# EAGLE design 10_Board_A_V1 (EAGLE 9.5.0)
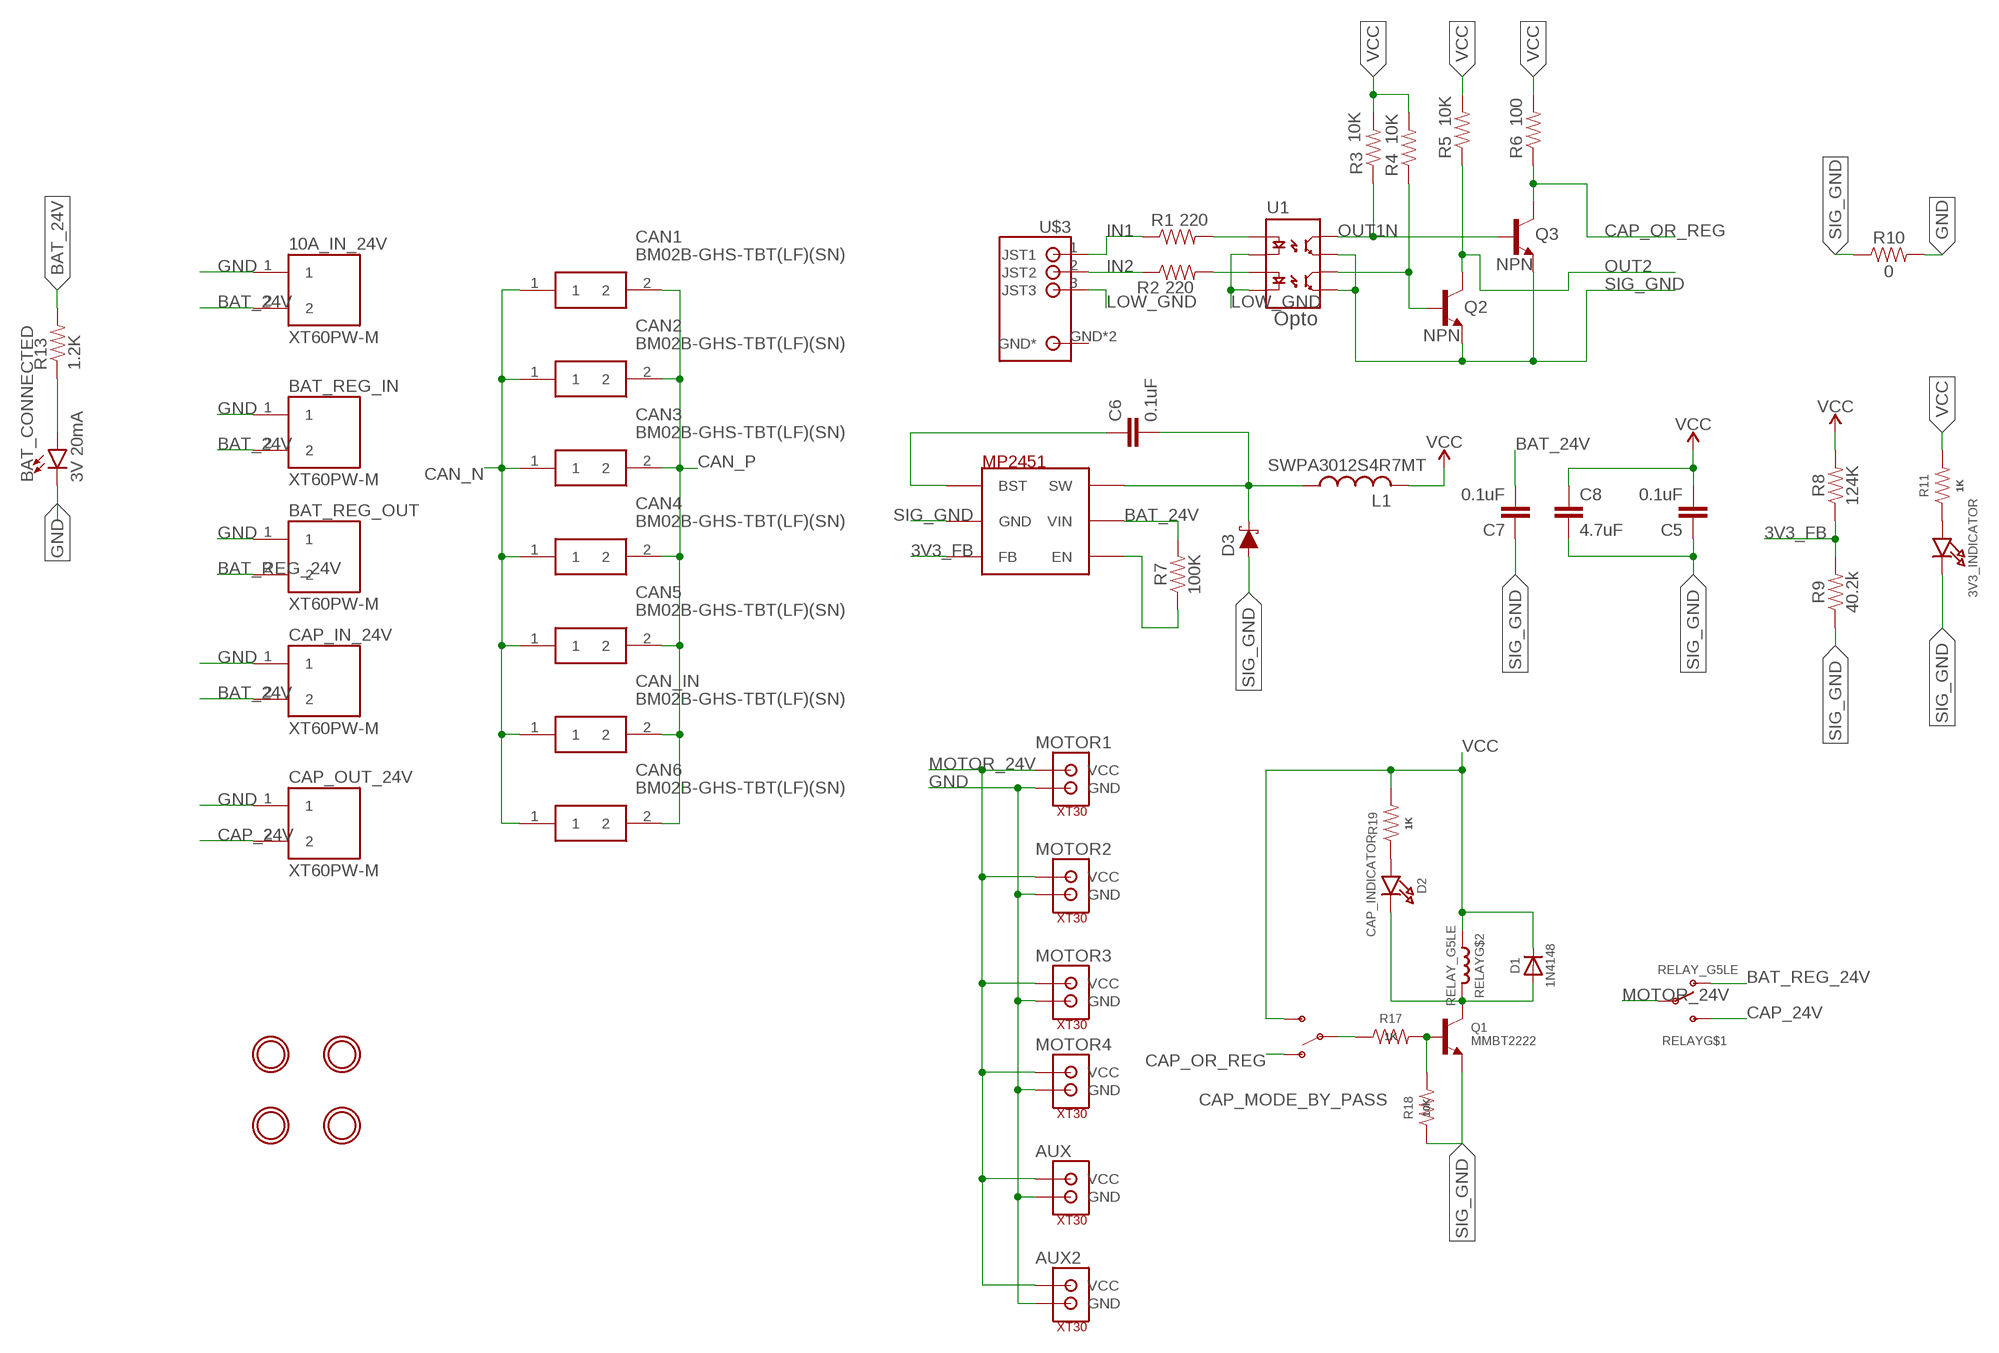
[diagram p0: schematic, sheet 1]

## Parts
3V3_INDICATOR  LED0805_NOOUTLINE  [CHIPLED_0805_NOOUTLINE]
10A_IN_24V  XT60PW-M  [AMASS_XT60PW-M]
AUX  XT30  [XT30]
AUX2  XT30  [XT30]
BAT_CONNECTED  3V 20mA  LED1206  [LED-1206]
BAT_REG_IN  XT60PW-M  [AMASS_XT60PW-M]
BAT_REG_OUT  XT60PW-M  [AMASS_XT60PW-M]
C5  0.1uF  0.1UF-0603-25V-(+80/-20%)  [0603]
C6  0.1uF  0.1UF-0603-25V-(+80/-20%)  [0603]
C7  0.1uF  0.1UF-0603-25V-(+80/-20%)  [0603]
C8  4.7uF  4.7UF-1206-16V-(+80/-20%)  [1206]
CAN1  BM02B-GHS-TBT(LF)(SN)  [BM02B-GHS-TBT_1]
CAN2  BM02B-GHS-TBT(LF)(SN)  [BM02B-GHS-TBT_1]
CAN3  BM02B-GHS-TBT(LF)(SN)  [BM02B-GHS-TBT_1]
CAN4  BM02B-GHS-TBT(LF)(SN)  [BM02B-GHS-TBT_1]
CAN5  BM02B-GHS-TBT(LF)(SN)  [BM02B-GHS-TBT_1]
CAN6  BM02B-GHS-TBT(LF)(SN)  [BM02B-GHS-TBT_1]
CAN_IN  BM02B-GHS-TBT(LF)(SN)  [BM02B-GHS-TBT_1]
CAP_IN_24V  XT60PW-M  [AMASS_XT60PW-M]
CAP_MODE_BY_PASS  SWITCH-SPDT-SMD-RIGHT-ANGLE  [SWITCH_SPST_SMD_A]
CAP_OUT_24V  XT60PW-M  [AMASS_XT60PW-M]
D1  1N4148  DIODESOD-323  [SOD-323]
D2  CAP_INDICATOR  LED0805_NOOUTLINE  [CHIPLED_0805_NOOUTLINE]
D3  3A/40V/500mV  DIODE-SCHOTTKY-B340A  [SMA-DIODE]
L1  SWPA3012S4R7MT  L-USL3230M  [L3230M]
MOTOR1  XT30  [XT30]
MOTOR2  XT30  [XT30]
MOTOR3  XT30  [XT30]
MOTOR4  XT30  [XT30]
MP2451  MP2451  [TSOT-23-6-SOT-23-6]
Q1  MMBT2222  TRANSISTOR_NPN  [SOT23-R]
Q2  NPN  TRANSISTOR_NPNMMBT2222A  [SOT23-3]
Q3  NPN  TRANSISTOR_NPNMMBT2222A  [SOT23-3]
R1  220  220OHM-1/10W-1%(0603)  [0603-RES]
R2  220  220OHM-1/10W-1%(0603)  [0603-RES]
R3  10K  10KOHM1/10W1%(0603)0603  [0603-RES]
R4  10K  10KOHM1/10W1%(0603)0603  [0603-RES]
R5  10K  10KOHM1/10W1%(0603)0603  [0603-RES]
R6  100  10KOHM1/10W1%(0603)0603  [0603-RES]
R7  100K  RESISTOR0603  [0603]
R8  124K  RESISTOR0603  [0603]
R9  40.2k  RESISTOR0603  [0603]
R10  0  RESISTOR1206  [1206]
R11  1K  RESISTOR0805-RES  [0805]
R13  1.2K  RESISTOR2010  [R2010]
R17  1K  RESISTOR0805-RES  [0805]
R18  10K  RESISTOR0805-RES  [0805]
R19  1K  RESISTOR0805-RES  [0805]
RELAY  RELAY_G5LE  [RELAY_G5LE-1]
U1  OPTOISOLATOR-2SOIC8  [SO08-2]
U$1  MOUNTINGHOLE2.5  [MOUNTINGHOLE_2.5_PLATED]
U$2  MOUNTINGHOLE2.5  [MOUNTINGHOLE_2.5_PLATED]
U$3  S3B-PH-SM4_TB  [S3B-PH-SM4_TB]
U$4  MOUNTINGHOLE2.5  [MOUNTINGHOLE_2.5_PLATED]
U$49  MOUNTINGHOLE2.5  [MOUNTINGHOLE_2.5_PLATED]

## Nets
3V3_FB [sig]: MP2451.PIN3(FB) R8.1 R9.2
BAT_24V: 10A_IN_24V.2 BAT_REG_IN.2 C7.2 CAP_IN_24V.2 MP2451.PIN5(VIN) R7.2 R13.2
BAT_REG_24V: BAT_REG_OUT.2 RELAY.3(O)
CAN_N [sig]: CAN1.1 CAN2.1 CAN3.1 CAN4.1 CAN5.1 CAN6.1 CAN_IN.1
CAN_P [sig]: CAN1.2 CAN2.2 CAN3.2 CAN4.2 CAN5.2 CAN6.2 CAN_IN.2
CAP_24V: CAP_OUT_24V.2 RELAY.4(S)
CAP_OR_REG [sig]: CAP_MODE_BY_PASS.1(O) Q3.3(C) R6.1
GND: 10A_IN_24V.1 AUX2.P$1(GND) AUX.P$1(GND) BAT_CONNECTED.C BAT_REG_IN.1 BAT_REG_OUT.1 CAP_IN_24V.1 CAP_OUT_24V.1 MOTOR1.P$1(GND) MOTOR2.P$1(GND) MOTOR3.P$1(GND) MOTOR4.P$1(GND) R10.2
IN1: R1.1 U$3.1(JST1)
IN2: R2.1 U$3.2(JST2)
LOW_GND: U1.2(C1) U1.4(C2) U$3.3(JST3)
MOTOR_24V: AUX2.P$2(VCC) AUX.P$2(VCC) MOTOR1.P$2(VCC) MOTOR2.P$2(VCC) MOTOR3.P$2(VCC) MOTOR4.P$2(VCC) RELAY.1(P)
N$1 [sig]: CAP_MODE_BY_PASS.2(P) R17.1
N$2: R1.2 U1.1(A1)
N$3: R2.2 U1.3(A2)
N$4 [sig]: MP2451.PIN4(EN) R7.1
N$5 [VCC]: C6.1 MP2451.PIN1(BST)
N$7 [VCC]: C6.2 D3.C L1.1 MP2451.PIN6(SW)
N$8: 3V3_INDICATOR.A R11.1
N$9 [sig]: BAT_CONNECTED.A R13.1
N$12: D1.A D2.C Q1.3(C) RELAY.5
N$22: Q1.1(B) R17.2 R18.2
N$26: D2.A R19.1
OUT1N: Q3.1(B) R3.1 U1.8(CL1)
OUT2: Q2.3(C) R5.1
OUT2N: Q2.1(B) R4.1 U1.6(CL2)
SIG_GND: 3V3_INDICATOR.C C5.1 C7.1 C8.2 D3.A MP2451.PIN2(GND) Q1.2(E) Q2.2(E) Q3.2(E) R9.1 R10.1 R18.1 U1.5(EM2) U1.7(EM1)
VCC [VCC]: C5.2 C8.1 CAP_MODE_BY_PASS.3(S) D1.C L1.2 R3.2 R4.2 R5.2 R6.2 R8.2 R11.2 R19.2 RELAY.2
Unconnected: U$3.GND2(GND*) U$3.GND(GND*)

## Notes on the sheet
- Opto

## Library data of the parts
3V3_INDICATOR D2 = microbuilder:LED: LED 0603 - 0603 Surface Mount Package 2mA: Green LED - Low Power (3.9mcd, 2ma, 1.7Vf) - Digikey: 475-2709-2-ND Orange LED - Low Power (9.8mcd, 2ma, 1.8Vf) - Digikey: 475-1194-2-ND Red LED - Low Power (5mcd, 2ma, 1.8Vf) - Digikey: 475-1195-2-ND Yellow LED - Low Power (7mcd, 2ma, 1.8Vf) - Digikey: 475-1196-2-ND 5mA: Blue LED - Low Power (17mcd, 5ma, 2.9Vf) - Digikey: LNJ937W8CRACT-ND 0805 - 0805 Surface Mount Package 2mA: Red LED (8.8mcd, 2mA, 1.8Vf, Clear) - Low Power [Digikey: 475-2510-1-ND] Green LED (5mcd, 2mA, 1.8Vf, Clear) - Low Power [Digikey: 475-2730-1-ND] Yellow LED (11.3mcd, 2mA, 1.8Vf, Clear) - Low Power [Digikey: 475-2555-1-ND] 20mA: Red LED (104mcd, 20mA, Diffused) - LS R976 [Digikey: 475-1278-6-ND] Red LED (12mcd, 20mA, 2.0Vf, Clear) - APT2012EC [Digikey: 754-1128-1-ND] Green LED (15mcd, 20mA, 2.2Vf, Clear) - APT2012GC [Digikey: 754-1131-1-ND] Orange LED (160mcd, 20mA, 2.1Vf, Clear) - APT2012SECK [Digikey: 754-1130-1-ND] 1206 - 1206 Surface Mount Package Green LED (26mcd, 20mA, Diffused) - LG N971 [Digikey: 475-1407-6-ND] Red LED (15mcd, 20mA, Diffused) - LH N974 [Digikey: 475-1416-6-ND] Cree - Cree High-Power Surface Mount LEDs XPEBWT-L1-0000-00D50 - White 111lm 350mA 2.9Vf 6200K 110° XTEAWT-00-0000-00000LEE3 - White 114lm 350mA 2.85Vf 5000K 115° Everlight - Everlight 45-21 Series Surface Mount LEDs 45-21/QK2C-B2832AC2CB2/2T - Warm White 2000mcd 20mA 3.25Vf 3050K 120° 45-21/LK2C-B38452C4CB2/2T - Nuetral White 2000mcd 20mA 3.25Vf 4150K 120° 45-21/LK2C-B50634C6CB2/2T - Cold White 2200mcd 20mA 3.25Vf 5650K 120° PLCC2 Reverse Mount LS T77K-J1L2-1-0-2-R18-Z - Red 11.25mcd 2mA 1.8Vf 630nm 120° LO T77K-L1M2-24-Z - Orange 19.6mcd 2mA 1.8Vf 606nm 120° LY T77K-K2M1-26-Z - Yellow 15.7mcd 2mA 1.8Vf 587nm 120°
10A_IN_24V BAT_REG_IN BAT_REG_OUT CAP_IN_24V CAP_OUT_24V = XT60PW-M:XT60PW-M; AVAILABILITY: Unavailable; MF: AMASS; MP: XT60PW-M; PACKAGE: Package Analog Devices; PRICE: None
AUX AUX2 MOTOR1-MOTOR4 = NewKevinMade:XT30
BAT_CONNECTED = SparkFun-LED:LED: LED (Generic) Standard schematic elements and footprints for 5mm, 3mm, 1206, and 0603 sized LEDs. Generic LEDs with no color specified.
C5-C7 = SparkFun-Capacitors:0.1UF: 0.1µF ceramic capacitors A capacitor is a passive two-terminal electrical component used to store electrical energy temporarily in an electric field.; PROD_ID: CAP-00810
C8 = SparkFun-Capacitors:4.7UF: 4.7µF ceramic capacitors A capacitor is a passive two-terminal electrical component used to store electrical energy temporarily in an electric field.; PROD_ID: CAP-10300
CAN1-CAN6 CAN_IN = SamacSys_Parts:BM02B-GHS-TBT(LF)(SN): GH 1.25mm header top entry 2 way JST GH Series, 1.25mm Pitch 2 Way Shrouded Straight PCB Header, Surface Mount, Solder Termination Source: Datasheet <http://uk.rs-online.com/web/p/products/7521762P>; DESCRIPTION: GH 1.25mm header top entry 2 way JST GH Series, 1.25mm Pitch 2 Way Shrouded Straight PCB Header, Surface Mount, Solder Termination; HEIGHT: mm; MANUFACTURER_NAME: JST (JAPAN SOLDERLESS TERMINALS); MANUFACTURER_PART_NUMBER: BM02B-GHS-TBT(LF)(SN); RS_PART_NUMBER: 7521762P
CAP_MODE_BY_PASS = SparkFun-Switches:SWITCH-SPDT: Single Pole, Double Throw (SPDT) Switch Single-pole, double-throw (SPDT) switch. Variant Overview SMD-AYZ0202 Surface Mount DPDT Switch <https://www.sparkfun.com/products/597> (COM-00597) Used on e.g. LilyPad Arduino USB - ATmega32U4 Board <https://www.sparkfun.com/products/12049> PTH-11.6X4.0MM SPDT Mini Power Switch <https://www.sparkfun.com/products/102> (COM-00102) Used on e.g. SparkFun Simon Says - Through-Hole Soldering Kit <https://www.sparkfun.com/products/10547> (KIT-10547) PTH-11.6X4.0MM-KIT KIT version of SPDT Mini Power Switch - Simplifies soldering by removing tStop of switch pins - only one side can be soldered. PTH-11.6X4.0MM-LOCK LOCK version of SPDT Mini Power Switch - Offset pins hold switch in place for easier soldering. SMD-RIGHT-ANGLE Surface Mount Right Angle Switch <https://www.sparkfun.com/products/10860> (COM-10860) Used on e.g. SparkFun ESP8266 Thing <https://www.sparkfun.com/products/13231>; PROD_ID: SWCH-10651; SF_SKU: COM-10860
D1 = microbuilder:DIODE: Diode SMA Model Volts Amps Type Vf Ir Digikey # Notes SSA34-E3 40V 3A Schottky 480mV @ 3A 200uA @ 40V SSA34-E3/61TGITR-ND CDBA120-G 20V 1A Schottky 500mV @ 1A 500uA @ 20V 641-1014-6-ND REEL MBRA210 10V 2A Schottky 350mV @ 2A 700uA @ 10V MBRA210LT3 SOD-123 Model Volts Amps Type Vf Ir Order # Notes BAT54T1G 30V 200mA Schottky 800mV @ 200mA 2uA @ 25V BAT54T1GOSTR-ND B0530W 30V 500mA Schottky 430mV @ 500mA 130uA @ 30V B0530W-FDICT-ND REEL MBR120 20V 1A Schottky 340mV @ 1A MBR120VLSFT1GOSCT-ND SOD-323 Model Volts Amps Type Vf Ir Order # Notes PMEG2005EJ 20V 500mA Schottky 355mV @ 500mA 568-4110-1-ND ZLLS410 10V 570mA Schottky 380mV @ 570mA ZLLS410CT-ND 1N4148WS 75V 150mA Silicon/Simple 1V 1N4148WSFSCT-ND REEL SOD-523 Model Volts Amps Type Vf Ir Order # Notes BAT54XV2 30V 200mA Schottky 0.8V @ 100mA BAT54XV2CT-ND TB751S 30V 30mA Schottky RB751S-40TE61CT-ND SOT23-R/W (R = Solder Paste/Reflow Ovens, W = Hand-Soldering) Model Volts Amps Type Vf Ir Order # Notes BAT54FILM 40V 300mA Schottky 497-7162-1-ND POWERDI-5 Model Volts Amps Type Vf Ir Order # Notes PDS560 60V 5A Schottky 670mV @ 5A 150uA @ 60V PDS560DICT-ND
D3 = SparkFun-DiscreteSemi:DIODE-SCHOTTKY: Schottky diode A Schottky diode is a semiconductor diode which has a low forward voltage drop and a very fast switching action.; PROD_ID: DIO-09886
L1 = rcl:L-US: INDUCTOR, American symbol; SPICEPREFIX: L
MP2451 = NewKevinMade:MP2451
Q1 = microbuilder:TRANSISTOR_NPN: NPN Transistor Transistor (NPN) 500mA 45V - BC817 [Digikey: 568-1631-1-ND] Transistor (NPN) 500mA 45V - BC817,215 [Mouser: 771-BC817-T/R] SOT23-R - SOT23 footprint optimised for use with solder paste and reflow ovens. SOT23-W - SOT23 footprint optimised for hand-soldering (larger pads).
Q2 Q3 = SparkFun-DiscreteSemi:TRANSISTOR_NPN: Generic NPN BJT MMBT2222A - TRANS-08049 (SOT-23, 1A 40V) MPSA42 - TRANS-09116 (SOT-23, 500mA 300V) MMBT5088LT1G - TRANS-11160 (SOT-23, 50 mA 30V) BC547 - COM-08928 <http://www.sparkfun.com/products/8928> (TO-92 45V 100mA) (1.Collector 2.Base 3.Emitter) 2N3904 - COM-00521 <http://www.sparkfun.com/products/521> (TO-92 40V 200mA) (1.Emitter 2.Base 3.Collector) P2N2222A - COM-12852 <http://www.sparkfun.com/products/12852> (TO-92 40V 600mA) (1.Collector 2.Base 3.Emitter); PROD_ID: TRANS-08049; VALUE: MMBT2222A
R1 R2 = SparkFun-Resistors:220OHM-1/10W-1%(0603): RES-07861; PROD_ID: RES-07861
R3-R5 = SparkFun-Resistors:10KOHM1/10W1%(0603): RES-00824; PROD_ID: RES-00824
R6 = SparkFun-Resistors:10KOHM1/10W1%(0603): RES-00824; PROD_ID: RES-00824; VALUE: 10K
R7-R10 = SparkFun-Resistors:RESISTOR: Generic Resistor Package
R11 R17-R19 = SparkFun-Resistors:RESISTOR: Resistor Basic schematic elements and footprints for 0603, 1206, and PTH resistors.
R13 = SparkFun-Passives:RESISTOR: Resistor Basic schematic elements and footprints for 0603, 1206, and PTH resistors.
RELAY = microbuilder:RELAY_G5LE
U1 = SparkFun-DiscreteSemi:OPTOISOLATOR-2: Description: Dual gate opto isolator. Vishay part : ILD213T; PROD_ID: IC-09076
U$1 U$2 U$4 U$49 = microbuilder:MOUNTINGHOLE: Mounting Hole For #2 screws (0.086"/2.18mm width, 0.094"/2.4mm hole) use 2.5mm; BOM: EXCLUDE
U$3 = NewKevinMade:S3B-PH-SM4_TB

## Net classes
0 default: width 0.305 mm, drill 0.305 mm, clearance 0.305 mm
1 sig: width 0.254 mm, drill 0.305 mm, clearance 0.127 mm
2 VCC: width 0.254 mm, drill 0.254 mm, clearance 0.127 mm

## Board
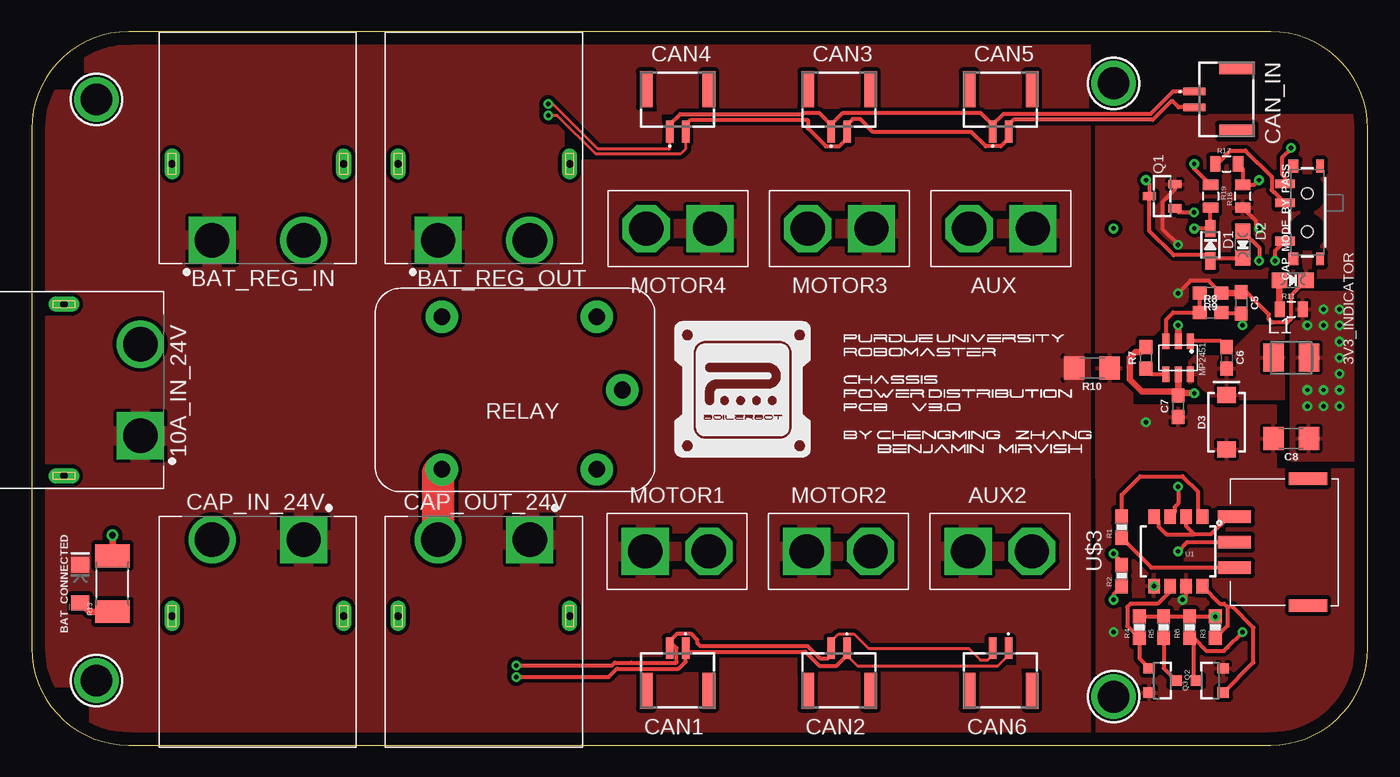
[diagram p1: board, top side]
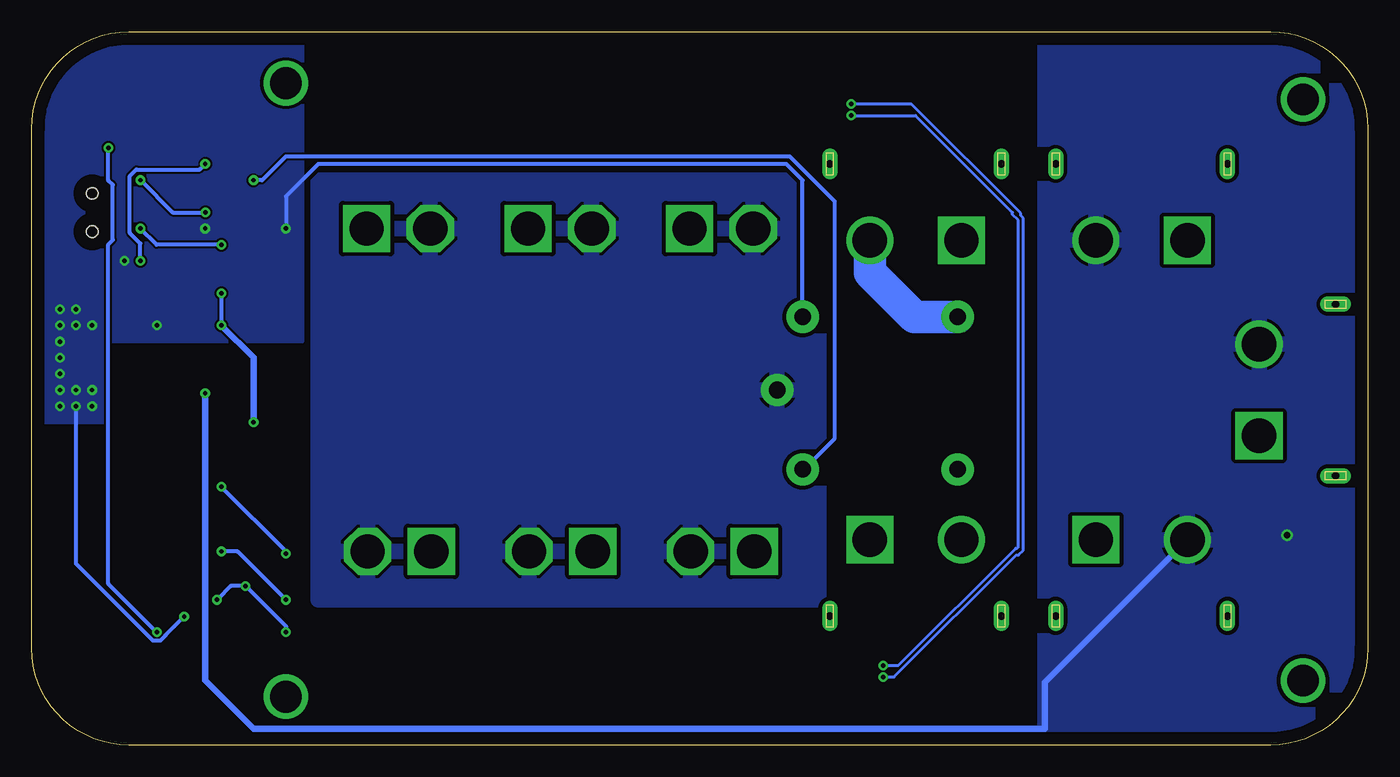
[diagram p2: board, bottom side, seen from below]

Size 105.08 x 56.12 mm. Coordinates in mm from the lower left corner, seen from the top.
Outline: 0,48.5 0,7.62 arc90 7.62,0 97.46,0 arc90 105.08,7.62 105.08,48.5 arc90 97.46,56.12 7.62,56.12 arc90 0,48.5
Copper layers (1*16): Top 0.035mm / dielectric 1.5mm / Bottom 0.035mm
Design rules "default *": minimum track width 6mil, minimum drill 0.35mm, track to track 6mil, track to pad 6mil, pad to pad 6mil, via to via 6mil, smd to smd 6mil, copper to edge 40mil, drill to drill 6mil, minimum pad ring 10mil, minimum via ring 8mil, stop-mask expansion 4mil, vias tented up to drill 20mil, thermal gap 10mil

### Footprints (pad centres in the part's own frame; a part is rotated, then mirrored left to right if it is on the bottom)
CHIPLED_0805_NOOUTLINE = smd 1.2 x 1.2: A 0,-1.05; C 0,1.05
AMASS_XT60PW-M = drill 2.7 square: 1 -3.6,-6 | drill 2.7: 2 3.6,-6 | drill 0.6 pad 1.2 long: S1 -6.75,0; S2 6.75,0
XT30 = drill 2.7 square: P$1 0,0 | drill 2.7 octagon: P$2 5,0
LED-1206 = smd 1.2 x 1.4: A -1.5,0; C 1.5,0
0603 = smd 1.1 x 1: 1 -0.85,0; 2 0.85,0
1206 = smd 1.6 x 1.8: 1 -1.4,0; 2 1.4,0
BM02B-GHS-TBT_1 = smd 0.6 x 1.7: 1 0.625,0; 2 -0.625,0 | smd 1 x 2.8: 3 -2.475,-3.35; 4 2.475,-3.35
SWITCH_SPST_SMD_A = smd 0.7 x 1.5: 1 -2.25,-1.75; 2 -0.75,-1.75; 3 2.25,-1.75 | smd 1 x 0.6: GND1 -3.65,1; GND3 3.65,1 | smd 1 x 0.8: GND2 -3.65,-1.1; GND4 3.65,-1.1 | hole 0.9: -1.5,0; 1.5,0
SOD-323 = smd 1.35 x 0.8: A 1.27,0; C -1.27,0
SMA-DIODE = smd 1.27 x 1.47: A -2.15,0; C 2.15,0
L3230M = smd 1.6 x 2.2: 1 -1.4,0; 2 1.4,0
TSOT-23-6-SOT-23-6 = smd 1.2 x 0.55: PIN1 -1.3,0.95; PIN2 -1.3,0; PIN3 -1.3,-0.95; PIN4 1.3,-0.95; PIN5 1.3,0; PIN6 1.3,0.95
SOT23-R = smd 0.635 x 1.016: 1 -0.95,-1; 2 0.95,-1; 3 0,1
SOT23-3 = smd 0.8 x 0.9: 1 -0.95,-1; 2 0.95,-1; 3 0,1.1
0603-RES = smd 1.1 x 1: 1 -0.85,0; 2 0.85,0
0805 = smd 0.8 x 1.2: 1 -0.9,0; 2 0.9,0
R2010 = smd 1.8 x 2.7: 1 -2.2,0; 2 2.2,0
RELAY_G5LE-1 = drill 1.3 pad 2.54: 1 -8.35,0; 2 -6.35,-5.75; 3 5.85,-5.75; 4 5.85,6.25; 5 -6.35,6.25
SO08-2 = smd 0.914 x 1.143: 1 -1.905,-2.731; 2 -0.635,-2.731; 3 0.635,-2.731; 4 1.905,-2.731; 5 1.905,2.731; 6 0.635,2.731; 7 -0.635,2.731; 8 -1.905,2.731
MOUNTINGHOLE_2.5_PLATED = drill 2.5 pad 3.2: P$1 0,0
S3B-PH-SM4_TB = smd 1 x 2.6: 1 3.81,8.28; 2 5.81,8.28; 3 7.81,8.28 | smd 1 x 3: GND 0.826,2.48; GND2 10.794,2.48

### Placement (x,y rotation side)
3V3_INDICATOR  99.19,36.58 270 top
10A_IN_24V  2.54,27.94 90 top
AUX  78.74,40.64 180 top
AUX2  73.66,15.24 0 top
BAT_CONNECTED  3.81,12.7 90 top
BAT_REG_IN  17.78,45.72 0 top
BAT_REG_OUT  35.56,45.72 0 top
C5  95.12,34.8 270 top
C6  93.98,30.48 270 top
C7  90.17,26.67 90 top
C8  99.06,24.13 180 top
CAN1  50.8,7.62 0 top
CAN2  63.5,7.62 0 top
CAN3  63.5,48.26 180 top
CAN4  50.8,48.26 180 top
CAN5  76.2,48.26 180 top
CAN6  76.2,7.62 0 top
CAN_IN  91.44,50.8 90 top
CAP_IN_24V  17.78,10.16 180 top
CAP_MODE_BY_PASS  100.33,41.91 270 top
CAP_OUT_24V  35.56,10.16 180 top
D1  92.71,39.37 270 top
D2  95.25,39.37 180 top
D3  93.98,25.4 90 top
L1  99.06,30.48 0 top
MOTOR1  48.26,15.24 0 top
MOTOR2  60.96,15.24 0 top
MOTOR3  66.04,40.64 180 top
MOTOR4  53.34,40.64 180 top
MP2451  90.17,30.48 270 top
Q1  88.9,43.18 90 top
Q2  88.9,5.08 270 top
Q3  92.71,5.08 90 top
R1  85.72,17.14 90 top
R2  85.72,13.34 90 top
R3  93.09,9.27 90 top
R4  87.12,9.27 90 top
R5  89.03,9.27 90 top
R6  91.06,9.27 90 top
R7  87.63,30.48 90 top
R8  92.71,34.04 0 top
R9  92.71,35.56 180 top
R10  83.39,29.67 180 top
R11  99.06,34.29 0 top
R13  6.35,12.7 90 top
R17  93.98,45.72 0 top
R18  95.25,43.18 90 top
R19  92.71,43.18 270 top
RELAY  38.1,27.94 180 top
U1  90.17,15.24 180 top
U$1  5.08,5.08 0 top
U$2  5.08,50.8 0 top
U$3  102.87,10.16 90 top
U$4  85.09,3.81 0 top
U$49  85.09,52.07 0 top

### Tracks (layer width: path | path; a pad name or v marks a point on that pad's centre or on a via)
3V3_FB
  Top 0.305: R9.2 R8.1 89.79,34.04 89.23,33.48 89.23,31.8 MP2451.PIN3
BAT_24V  (via drill 0.35, 0.51)
  Top 0.508: MP2451.PIN5 C7.2 | C7.2 89.87,27.82 87.31,27.82 86.37,28.76 86.37,30.5 86.81,30.94 87.24,30.94 R7.2 | v91.44,27.69 90.34,27.69 C7.2 | R13.2 v6.35,16.51
  Bottom 0.508: CAP_IN_24V.2 25.4,4.94 25.4,1.27 87.63,1.27 91.44,5.08 v91.44,27.69
  pour Bottom: 0,55.88 0,0 25.4,0 25.4,57.15 0,57.15
BAT_REG_24V
  Bottom 2.54: RELAY.3 35.67,33.69 39.16,37.18 BAT_REG_OUT.2
CAN_N  (via drill 0.35)
  Top 0.254: CAN4.1 50.17,46.9 44.54,46.9 41,50.44 v40.64,50.44 | CAN6.1 76.83,7.07 75.99,6.23 64.96,6.23 64.12,7.07
  Top 0.305: 75.58,48.81 76.42,49.66 87.99,49.66 89.75,51.42 CAN_IN.1 | 62.88,48.81 63.78,49.71 74.67,49.71 75.58,48.81 | CAN5.1 75.58,48.81 | 62.88,48.81 CAN3.1 | 62.88,48.81 61.93,49.76 60.77,49.76 60.67,49.66 51.02,49.66 50.17,48.81 CAN4.1 | v38.1,5.35 45.37,5.35 46.04,6.03 46.06,6.01 50.88,6.01 51.42,6.55 CAN1.1 51.7,7.34 60.84,7.34 61.94,6.25 63.3,6.25 64.12,7.07 CAN2.1
  Bottom 0.254: v40.64,50.44 35.89,50.44 27.3,41.84 27.3,41.67 27.09,41.46 27.09,15.33 27.46,14.95 27.65,14.95 37.25,5.35 v38.1,5.35
CAN_P  (via drill 0.35)
  Top 0.254: CAN4.2 51.42,46.9 51.02,46.5 44.37,46.5 41.34,49.53 v40.64,49.53 | CAN6.2 75.58,7.07 75.2,6.7 74.61,6.7 73.71,7.6 65.81,7.6 64.66,8.75 63.45,8.75 62.88,8.17 CAN2.2
  Top 0.305: CAN_IN.2 90.22,50.17 89.74,50.66 89.63,50.66 88.18,49.2 77.22,49.2 76.83,48.81 CAN5.2 76.83,47.71 76.22,47.1 75.04,47.1 73.9,48.24 66.18,48.24 65.17,49.26 64.57,49.26 64.12,48.81 CAN3.2 64.12,47.71 63.52,47.1 62.45,47.1 61.03,48.52 61.03,49.15 60.98,49.2 51.82,49.2 51.42,48.81 CAN4.2 | v38.1,6.26 45.63,6.26 45.85,6.48 47.16,6.48 47.17,6.47 47.26,6.47 47.26,6.46 50.63,6.46 50.67,6.51 50.7,6.51 50.73,6.53 50.73,7.62 50.17,8.17 | CAN2.2 62.88,7.07 62.63,6.83 62,6.83 61.03,7.8 52.58,7.8 52.34,8.05 52.34,8.29 51.85,8.78 50.78,8.78 50.17,8.17 | CAN1.2 50.17,8.17
  Bottom 0.254: v40.64,49.53 35.56,49.53 27.94,41.91 27.94,41.73 27.49,41.29 27.49,15.59 27.59,15.5 27.68,15.5 36.92,6.26 v38.1,6.26
CAP_24V
  Top 2.54: RELAY.4 31.96,21.4 CAP_OUT_24V.2
CAP_OR_REG  (via drill 0.35)
  Top 0.305: CAP_MODE_BY_PASS.1 98.58,44.66 98.37,44.87 98.37,46.25 99.06,46.94 v99.06,46.99 | R6.1 91.39,8.42 | 91.39,8.42 92.4,7.41 93.78,7.41 94.05,7.68 94.05,7.69 v95.25,8.89 | Q3.3 91.39,5.3 91.39,8.42
  Bottom 0.305: v95.25,8.89 99.06,12.7 99.06,39.39 98.71,39.74 98.71,44.08 99.06,44.43 v99.06,46.99
GND
  pour Top: 0,57.15 0,0 82.55,0 82.55,57.15
IN1
  Top 0.305: R1.1 88.05,13.97 U$3.1
IN2  (via drill 0.35)
  Top 0.305: R2.1 85.09,11.85 v85.09,11.43 | v90.17,15.24 90.9,15.97 U$3.2
  Bottom 0.305: v85.09,11.43 88.9,15.24 v90.17,15.24
LOW_GND
  Top 0.305: U$3.3 94.14,17.97 92.75,16.58 91.44,16.58 | 91.44,16.58 90.81,17.21 U1.2 | U1.4 88.62,17.61 88.62,17.21 89.25,16.58 91.44,16.58
MOTOR_24V
  pour Bottom: 43.18,44.45 43.18,11.43 82.55,11.43 82.55,44.45
N$1
  Top 0.305: CAP_MODE_BY_PASS.2 97.73,43.5 97.7,43.5 97.53,43.68 97.53,44.72 95.47,46.78 94.29,46.78 93.23,45.72 R17.1
N$2
  Top 0.305: R1.2 85.72,19.68 87.19,21.16 90.52,21.16 91.72,19.95 91.72,18.33 U1.1
N$3  (via drill 0.35)
  Top 0.305: R2.2 85.72,14.43 v85.09,15.06 | U1.3 89.89,18.33 89.89,18.73 90.17,19.01 v90.17,20.32
  Bottom 0.305: v85.09,15.06 85.09,15.24 v90.17,20.32
N$4
  Top 0.305: R7.1 88.08,29.18 MP2451.PIN4
N$5
  Top 0.305: C6.1 93.53,31.78 MP2451.PIN1
N$7
  pour Top: 90.93,29.97 90.93,28.57 91.69,28.57 92.96,27.3 98.42,27.3 98.42,32.77 98.55,32.89 96.39,32.89 93.98,30.48 91.44,30.48
N$8
  Top 0.508: 3V3_INDICATOR.A 98.14,34.31 R11.1
N$9
  Top 0.508: BAT_CONNECTED.A 4.51,10.5 R13.1
N$12  (via drill 0.35)
  Top 0.305: D2.C 92.93,38.32 D1.A 92.28,38.53 89.82,38.53 87.9,40.46 Q1.3 87.9,44.18 v87.63,44.45
  Bottom 0.305: RELAY.5 44.35,21.69 41.91,24.13 41.91,42.77 45.47,46.33 85.09,46.33 86.97,44.45 v87.63,44.45
N$22  (via drill 0.35)
  Top 0.305: R17.2 95.25,45.35 R18.2 96.15,44.08 v96.52,44.45 | v91.43,41.91 90.22,41.91 Q1.1
  Bottom 0.305: v96.52,44.45 93.98,41.91 v91.43,41.91
N$26  (via drill 0.35)
  Top 0.305: R19.1 91.44,45.35 v91.44,45.72 | D2.A 96.53,39.14 v96.53,38.1
  Bottom 0.305: v96.53,38.1 96.53,39.46 97.37,40.29 97.37,44.78 96.87,45.28 91.88,45.28 v91.44,45.72
OUT1N
  Top 0.305: 94.05,10.86 94.05,9.38 R3.1 | U1.8 93.46,11.13 93.78,11.13 94.05,10.86 | 94.05,10.86 94.46,10.86 96.08,9.24 96.08,6.5 Q3.1
OUT2
  Top 0.305: R5.1 89.03,6.05 Q2.3
OUT2N
  Top 0.305: Q2.1 87.12,6.81 R4.1 86.17,9.38 86.17,10.86 86.43,11.13 88.56,11.13 89.53,12.1 U1.6
SIG_GND  (via drill 0.35)
  Top 0.305: R9.1 92.6,36.52 91.12,36.52 90.85,36.25 90.85,36.24 v90.17,35.56 | Q1.2 89.9,43.7 88.94,42.74 88.94,40.6 v90.17,39.37 | v96.53,40.64 96.31,40.87 96.31,41.21 95.25,42.27 R18.1 | v90.5,11.43 90.81,11.73 U1.7 | 3V3_INDICATOR.C 99.02,35.36 99.02,33.5 98.75,33.23 97.57,33.23 97.3,33.5 97.3,33.89 95.55,35.65 C5.1
  Top 0.508: R9.1 95.03,35.56 C5.1 | MP2451.PIN2 v90.17,33.02
  Bottom 0.305: v90.17,35.56 v90.17,33.02 | v90.17,39.37 95.26,39.37 v96.53,40.64 | v90.5,11.43 89.42,12.51 U1.5 85.09,9.33 v85.09,8.89
  Bottom 0.508: v90.17,33.02 87.63,30.48 v87.63,25.4
  other vias: 88.27,12.51
  pour Top: 83.82,21.59 83.82,0 104.14,0 104.14,21.59
  pour Top: 97.79,26.67 97.79,20.96 83.82,20.96 83.82,49.53 104.14,49.53 104.14,36.83 92.71,36.83 86.49,30.61 86.49,26.67
VCC  (via drill 0.35)
  Top 0.305: R8.2 93.65,33.95 C5.2 95.25,33.82 v95.25,33.02 | R19.2 D1.C v91.44,40.64 | CAP_MODE_BY_PASS.3 97.79,38.87 v97.79,38.1 | R4.2 R5.2 R6.2 R3.2
  Bottom 0.305: v101.6,26.67 101.6,14.27 95.53,8.21 94.97,8.21 94.57,8.61 94.57,8.64 R3.2 | RELAY.2 44.45,44.45 45.72,45.72 82.55,45.72 85.09,43.18 v85.09,40.64
  other vias: 101.6,34.29 101.6,33.02 100.33,33.02 101.6,27.94 100.33,27.94 100.33,26.67 93.09,10.12 102.87,34.29 102.87,33.02 102.87,31.75 102.87,30.48 102.87,29.21 102.87,27.94 102.87,26.67
  pour Top: 99.06,35.56 99.06,22.48 104.14,22.48 104.14,35.56
  pour Bottom: 83.82,57.15 83.82,31.75 99.06,31.75 99.06,25.4 106.68,25.4 106.68,57.15

### Text on the board
tPlace: /Users/ChengMing/Desktop/The offical logo.bmp